# EAGLE design HC-OutTemp_revA (EAGLE 7.3.0)
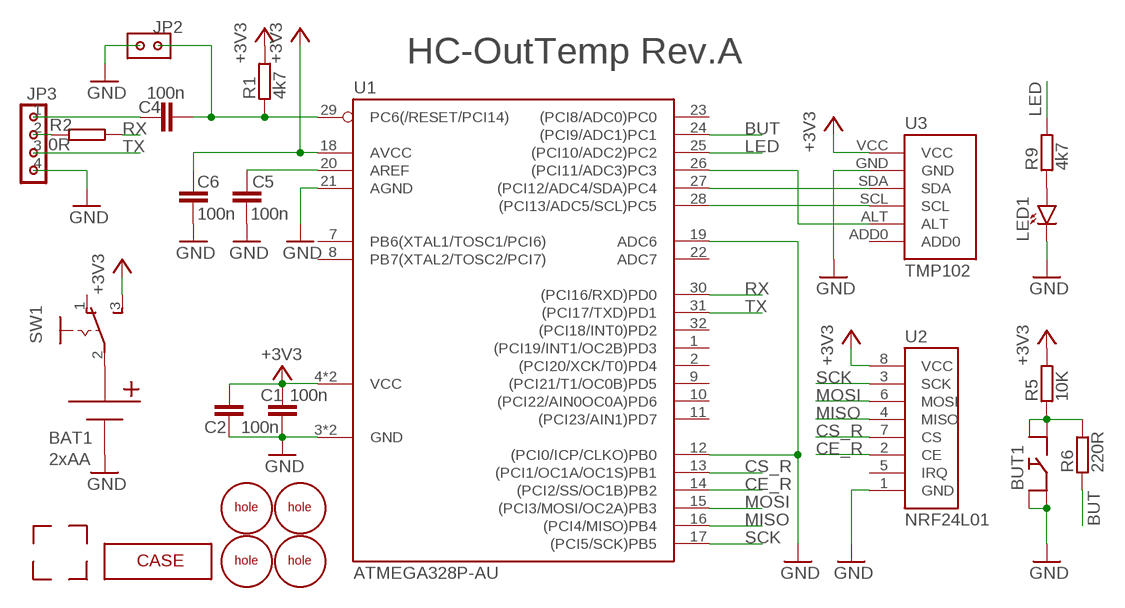
[diagram p0: schematic, sheet 1]

## Parts
BAT1  2xAA  BATTERY_1X'DOUBLE'  [2XAA_BATTERY_HOLDER]
BUT1  BUTTON'THT'  [BUTTON]
C1  100n  C-CERAMIC'SMD'  [C0805]
C2  100n  C-CERAMIC'SMD'  [C0805]
C4  100n  C-CERAMIC'SMD'  [C0805]
C5  100n  C-CERAMIC'SMD'  [C0805]
C6  100n  C-CERAMIC'SMD'  [C0805]
JP2  PINHD2X1  PINHD-2X1  [PINHD-2X1]
JP3  PINHD3X1  PINHD-4X1  [PINHD-4X1-90]
LED1  LED'3MM'  [LED3MM]
R1  4k7  R'2'  [R0805]
R2  0R  R'2'  [R0805]
R5  10K  R'2'  [R0805]
R6  220R  R'2'  [R0805]
R9  4k7  R'2'  [R0805]
SW1  SWITCH_SLIDE  [SLIDE_SWITCH]
U1  ATMEGA328P-AU  [QFP80P900X900X120-32N]
U2  NRF24L01  [NRF24L01]
U3  TMP102  [TMP102]
U$1  CORNER  [CORNER]
U$2  CORNER  [CORNER]
U$3  CORNER  [CORNER]
U$4  CORNER  [CORNER]
U$5  HOLE  [HOLE]
U$6  HOLE  [HOLE]
U$7  HOLE  [HOLE]
U$8  HOLE  [HOLE]
U$9  CASE'120X80X40'  [CASE-120X80X40]

## Nets
+3V3: C1.2 C2.2 C6.2 R1.2 R5.2 SW1.3(S) U1.4(VCC) U1.6(VCC) U1.18(AVCC) U2.8(VCC) U3.VCC
BUT: R6.1 U1.24((PCI9/ADC1)PC1)
CE_R: U1.14((PCI2/SS/OC1B)PB2) U2.2(CE)
CS_R: U1.13((PCI1/OC1A/OC1S)PB1) U2.7(CS)
GND: BAT1.N BUT1.2 BUT1.4 C1.1 C2.1 C5.2 C6.1 JP2.1 JP3.4 LED1.K U1.3(GND) U1.5(GND) U1.12((PCI0/ICP/CLKO)PB0) U1.19(ADC6) U1.21(AGND) U2.1(GND) U3.GND
LED: R9.2 U1.25((PCI10/ADC2)PC2)
MISO: U1.16((PCI4/MISO)PB4) U2.4(MISO)
MOSI: U1.15((PCI3/MOSI/OC2A)PB3) U2.6(MOSI)
N$1: BAT1.P SW1.2(MIDDLE)
N$2: C4.1 JP2.2 R1.1 U1.29(PC6(/RESET/PCI14))
N$3: LED1.A R9.1
N$4: U1.26((PCI11/ADC3)PC3) U3.ALT
N$5: C5.1 U1.20(AREF)
N$6: C4.2 JP3.1
N$7: BUT1.1 BUT1.3 R5.1 R6.2
N$8: JP3.2 R2.2
N$9: U1.27((PCI12/ADC4/SDA)PC4) U3.SDA
N$10: U1.28((PCI13/ADC5/SCL)PC5) U3.SCL
RX: R2.1 U1.30((PCI16/RXD)PD0)
SCK: U1.17((PCI5/SCK)PB5) U2.3(SCK)
TX: JP3.3 U1.31((PCI17/TXD)PD1)
Unconnected: SW1.1(O) U1.1((PCI19/INT1/OC2B)PD3) U1.2((PCI20/XCK/T0)PD4) U1.7(PB6(XTAL1/TOSC1/PCI6)) U1.8(PB7(XTAL2/TOSC2/PCI7)) U1.9((PCI21/T1/OC0B)PD5) U1.10((PCI22/AIN0OC0A)PD6) U1.11((PCI23/AIN1)PD7) U1.22(ADC7) U1.23((PCI8/ADC0)PC0) U1.32((PCI18/INT0)PD2) U2.5(IRQ) U3.ADD0

## Notes on the sheet
- HC-OutTemp Rev.A

## Library data of the parts
BAT1 = 1_domaci:BATTERY_1X
BUT1 = 1_domaci:BUTTON
C1 C2 C4-C6 = 1_domaci:C-CERAMIC
JP2 = 1_domaci:PINHD-2X1
JP3 = 1_domaci:PINHD-4X1: PIN HEADER
LED1 = 1_domaci:LED
R1 R2 R5 R6 R9 = 1_domaci:R
SW1 = 1_domaci:SWITCH_SLIDE
U1 = 1_domaci:ATMEGA328P-AU: 8-bit Microcontroller with In-System Programmable Flash
U2 = 1_domaci:NRF24L01
U3 = 1_domaci:TMP102
U$1-U$4 = 1_domaci:CORNER
U$5-U$8 = 1_domaci:HOLE
U$9 = 1_domaci:CASE

## Board
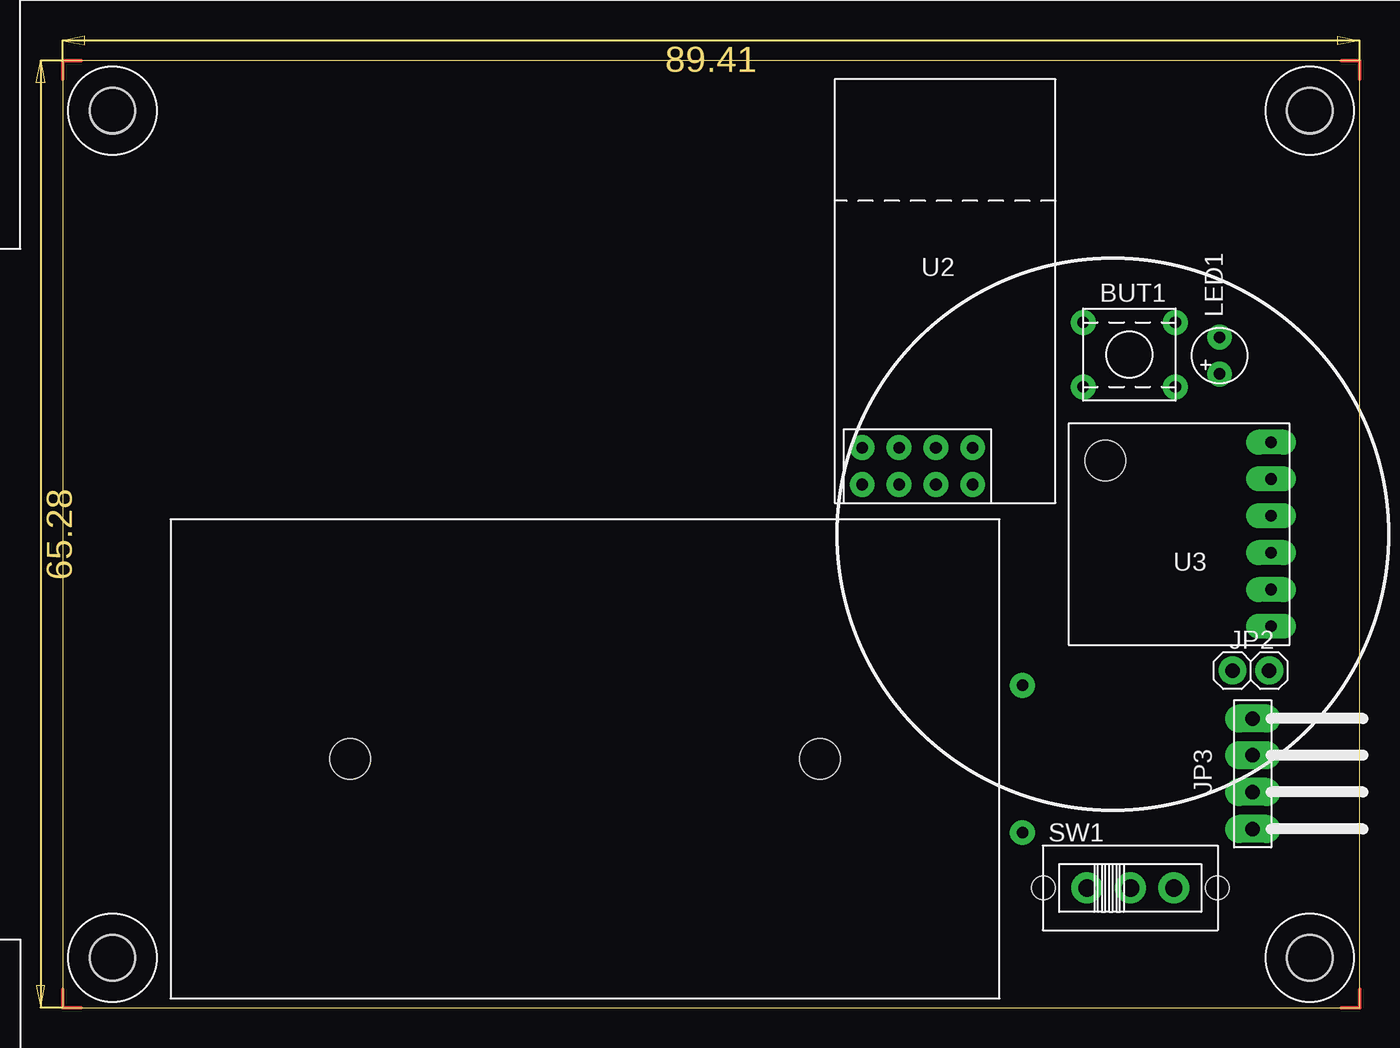
[diagram p1: board, top side]
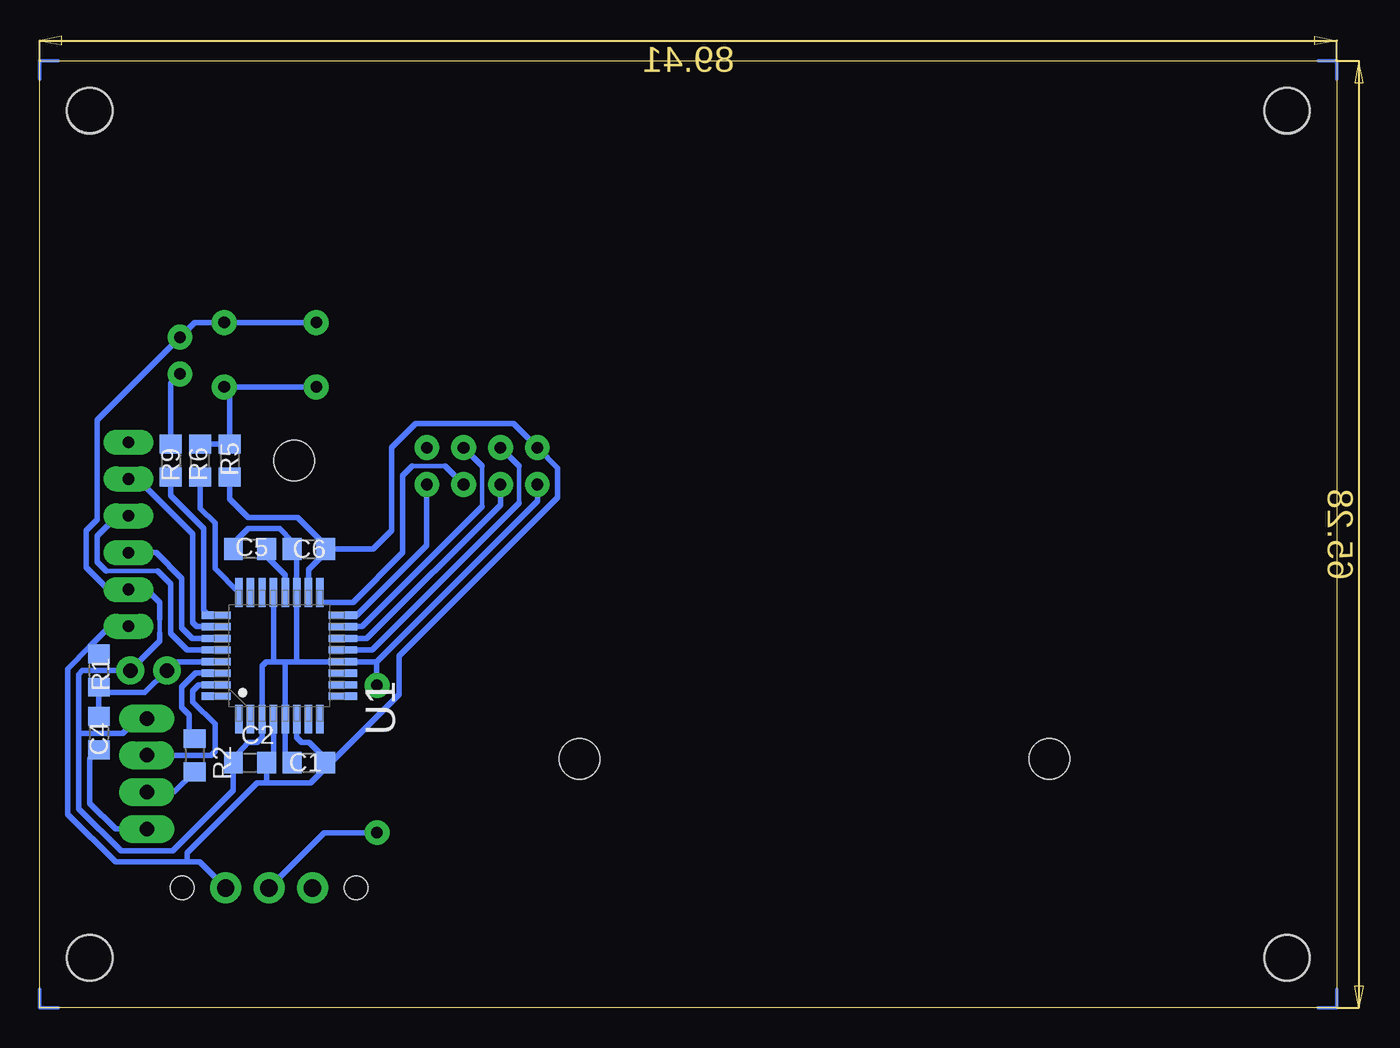
[diagram p2: board, bottom side, seen from below]

Size 89.41 x 65.28 mm. Coordinates in mm from the lower left corner, seen from the top.
Outline: 0,65.28 0,0 89.41,0 89.41,65.28 0,65.28
Copper layers (1*16): Top 0.035mm / dielectric 1.5mm / Bottom 0.035mm
Design rules "default *": minimum track width 10mil, minimum drill 24mil, track to track 8mil, track to pad 8mil, pad to pad 8mil, via to via 8mil, smd to smd 8mil, copper to edge 40mil, drill to drill 8mil, minimum pad ring 18mil, minimum via ring 20mil, stop-mask expansion 5mil, vias tented up to drill 0mil, thermal gap 10mil

### Footprints (pad centres in the part's own frame; a part is rotated, then mirrored left to right if it is on the bottom)
2XAA_BATTERY_HOLDER = drill 0.8: N -30.48,-5.08; P -30.48,5.08 | hole 2.8: -16.51,0; 15.875,0
BUTTON = drill 0.8 pad 1.676: 1 -2.54,-2.54; 2 -2.54,1.905; 3 3.81,-2.54; 4 3.81,1.905
C0805 = smd 1.3 x 1.5: 1 -1.143,0; 2 1.143,0
PINHD-2X1 = drill 1 pad 1.676: 1 -1.27,0; 2 1.27,0
PINHD-4X1-90 = drill 1 long: 1 3.81,0; 2 1.27,0; 3 -1.27,0; 4 -3.81,0
LED3MM = drill 0.8: A -1.27,0; K 1.27,0
R0805 = smd 1.3 x 1.5: 1 -1.143,0; 2 1.143,0
SLIDE_SWITCH = drill 1.2: 1 -2.921,0; 2 0.076,0; 3 3.073,0 | hole 1.6: 6.071,0; -5.918,0
QFP80P900X900X120-32N = smd 1.981 x 0.508: 1 -4.369,2.794; 2 -4.369,2.007; 3 -4.369,1.194; 4 -4.369,0.406; 5 -4.369,-0.406; 6 -4.369,-1.194; 7 -4.369,-2.007; 8 -4.369,-2.794; 17 4.369,-2.794; 18 4.369,-2.007; 19 4.369,-1.194; 20 4.369,-0.406; 21 4.369,0.406; 22 4.369,1.194; 23 4.369,2.007; 24 4.369,2.794 | smd 0.508 x 1.981: 9 -2.794,-4.369; 10 -2.007,-4.369; 11 -1.194,-4.369; 12 -0.406,-4.369; 13 0.406,-4.369; 14 1.194,-4.369; 15 2.007,-4.369; 16 2.794,-4.369; 25 2.794,4.369; 26 2.007,4.369; 27 1.194,4.369; 28 0.406,4.369; 29 -0.406,4.369; 30 -1.194,4.369; 31 -2.007,4.369; 32 -2.794,4.369
NRF24L01 = drill 0.8: 1 -1.27,5.08; 2 -1.27,2.54; 3 -1.27,0; 4 -1.27,-2.54; 5 1.27,-2.54; 6 1.27,0; 7 1.27,2.54; 8 1.27,5.08
TMP102 = drill 0.8 long: ADD0 -6.35,-6.35; ALT -6.35,-3.81; GND -6.35,3.81; SCL -6.35,-1.27; SDA -6.35,1.27; VCC -6.35,6.35 | hole 2.8: 5.08,-5.08
HOLE = hole 3.048: 0,0
CASE-120X80X40 = hole 3.2: 18.415,69.215; 100.965,69.215; 100.965,10.795; 18.415,10.795

### Placement (x,y rotation side)
BAT1  35.69,17.14 180 top
BUT1  72.9,45.34 0 top
C1  70.87,16.89 0 bottom
C2  74.93,16.89 0 bottom
C4  85.34,18.92 270 bottom
C5  74.93,31.62 180 bottom
C6  70.87,31.62 0 bottom
JP2  81.91,23.24 180 top
JP3  82.04,16.13 270 top
LED1  79.76,44.96 90 top
R1  85.34,23.24 90 bottom
R2  78.74,17.4 270 bottom
R5  76.33,37.72 270 bottom
R6  78.36,37.72 90 bottom
R9  80.39,37.72 270 bottom
SW1  73.53,8.26 0 top
U1  72.9,24.26 90 bottom
U2  60.2,37.34 90 top
U3  76.96,32.64 180 top
U$1  88.77,64.64 180 top
U$2  0.63,0.63 0 top
U$3  0.63,64.64 270 top
U$4  88.77,0.63 90 top
U$5  85.98,61.85 90 top
U$6  85.98,3.43 90 top
U$7  3.43,61.85 90 top
U$8  3.43,3.43 90 top
U$9  -14.99,-7.37 0 top

### Tracks (layer width: path | path; a pad name or v marks a point on that pad's centre or on a via)
+3V3
  Bottom 0.381: U1.4 73.3,17.37 C2.2 73.79,15.49 | U1.6 71.7,18.62 71.37,18.29 70.87,18.29 69.72,17.14 C1.2 | U1.18 70.89,30.2 69.72,31.37 C6.2 | 73.79,15.49 70.74,15.49 69.34,16.89 | C6.2 69.72,31.88 71.63,33.78 75.06,33.78 76.33,35.05 R5.2 | U3.VCC 84.58,26.29 85.98,24.89 | C1.2 69.72,16.76 | 79.25,10.03 84.2,10.03 87.5,13.34 87.5,23.37 85.98,24.89 | 79.25,10.03 79.25,10.67 74.42,15.49 73.79,15.49 | 79.25,10.03 78.38,10.03 SW1.3 | 69.34,16.89 64.64,21.59 64.64,24.26 53.72,35.18 53.72,37.21 U2.8 56.77,40.26 63.5,40.26 65.15,38.61 65.15,32.89 66.42,31.62 C6.2 | 69.34,16.89 C1.2 | R1.2 85.85,24.89 85.98,24.89
BUT
  Bottom 0.381: R6.1 78.36,34.42 77.34,33.4 77.34,30.28 U1.24
CE_R
  Bottom 0.381: U2.2 57.66,34.67 66.88,25.45 U1.14
CS_R
  Bottom 0.305: 56.39,34.8 56.39,35.31 56.39,37.34
  Bottom 0.381: 56.39,37.34 U2.7 | U1.13 66.52,24.66 56.39,34.8
GND
  Bottom 0.305: 81.15,25.78 81.15,26.8
  Bottom 0.381: C1.1 72.49,17.25 U1.5 72.49,23.75 72.39,23.85 | C2.1 76.07,17.14 75.06,18.29 74.42,18.29 74.09,18.62 U1.3 74.09,23.57 73.81,23.85 73.28,23.85 | C5.2 76.07,32 75.06,33.02 72.9,33.02 72.01,32.13 C6.1 71.7,31.32 U1.19 71.7,23.93 71.63,23.85 | BUT1.2 BUT1.4 78.74,47.24 LED1.K 85.47,40.51 85.47,33.66 86.23,32.89 86.23,30.35 84.71,28.83 U3.GND 82.04,28.83 81.15,27.94 81.15,26.8 | U2.1 55.12,34.92 66.19,23.85 | C2.1 76.07,16.51 | 71.63,23.85 U1.12 66.19,23.85 | 71.63,23.85 72.39,23.85 | 72.39,23.85 73.28,23.85 | U1.21 73.3,23.88 73.28,23.85 | JP3.4 82.68,19.94 83.69,18.92 86.74,18.92 | 86.74,18.92 86.74,22.99 86.49,23.24 JP2.1 81.15,25.27 81.15,25.78 | 86.74,18.92 86.74,13.72 83.82,10.8 80.26,10.8 76.07,14.99 C2.1 | BAT1.N 66.19,22.25 66.19,23.85
LED
  Bottom 0.381: U1.25 77.77,27.05 78.1,27.38 78.1,33.02 80.39,35.31 R9.2
MISO
  Bottom 0.381: U1.16 67.56,27.05 62.74,31.88 62.74,32.38 62.74,32.77 U2.4
MOSI
  Bottom 0.305: 58.93,34.54 58.93,37.34
  Bottom 0.381: 58.93,37.34 U2.6 | U1.15 67.21,26.26 58.93,34.54
N$1
  Bottom 0.381: BAT1.P 69.8,12.07 SW1.2
N$2
  Bottom 0.381: U1.29 79.91,23.85 JP2.2 82.17,21.72 85.34,21.72 | 85.34,21.72 85.85,21.72 R1.1 | C4.1 85.34,21.72
N$3
  Bottom 0.381: R9.1 80.39,43.05 LED1.A
N$4
  Bottom 0.381: U1.26 78.59,26.26 78.87,26.54 78.87,32.64 82.68,36.45 U3.ALT
N$5
  Bottom 0.381: U1.20 72.49,29.82 73.79,31.12 C5.1
N$6
  Bottom 0.381: JP3.1 84.2,12.32 85.98,14.1 85.98,17.14 C4.2
N$7
  Bottom 0.381: BUT1.1 BUT1.3 76.33,42.42 R5.1 R6.2
N$8
  Bottom 0.381: JP3.2 80.14,14.86 R2.2
N$9
  Bottom 0.381: U1.27 78.92,25.45 79.63,26.16 79.63,29.59 81.41,31.37 U3.SDA
N$10
  Bottom 0.305: 81.28,30.1 84.84,30.1
  Bottom 0.381: U1.28 79.27,24.66 80.39,25.78 80.39,29.21 81.28,30.1 | 84.84,30.1 85.47,30.73 85.47,32.51 84.07,33.91 U3.SCL
RX
  Bottom 0.381: U1.30 78.66,23.06 79.63,22.1 79.63,20.7 79.12,20.19 79.12,19.18 R2.1
SCK
  Bottom 0.305: 61.47,37.34 63.75,37.34
  Bottom 0.381: U2.3 61.47,37.34 | 63.75,37.34 64.39,36.7 64.39,31.37 67.82,27.94 69.98,27.94 70.1,28.07 U1.17
TX
  Bottom 0.381: U1.31 78.46,22.25 78.87,21.84 78.87,21.08 77.34,19.56 77.34,17.65 77.6,17.4 JP3.3